# EasyEDA Pro project 程控增益块pe43711.eprj

# Schematic Schematic1

## Sheets
1 P1: Create Date: 2023-07-19; Page Name: P1; Project Name: 程控增益块pe43711; Schematic Name: Schematic1; Update Date: 2023-07-20; Company: 嘉立创EDA; Page Size: A4; Version: V1.0
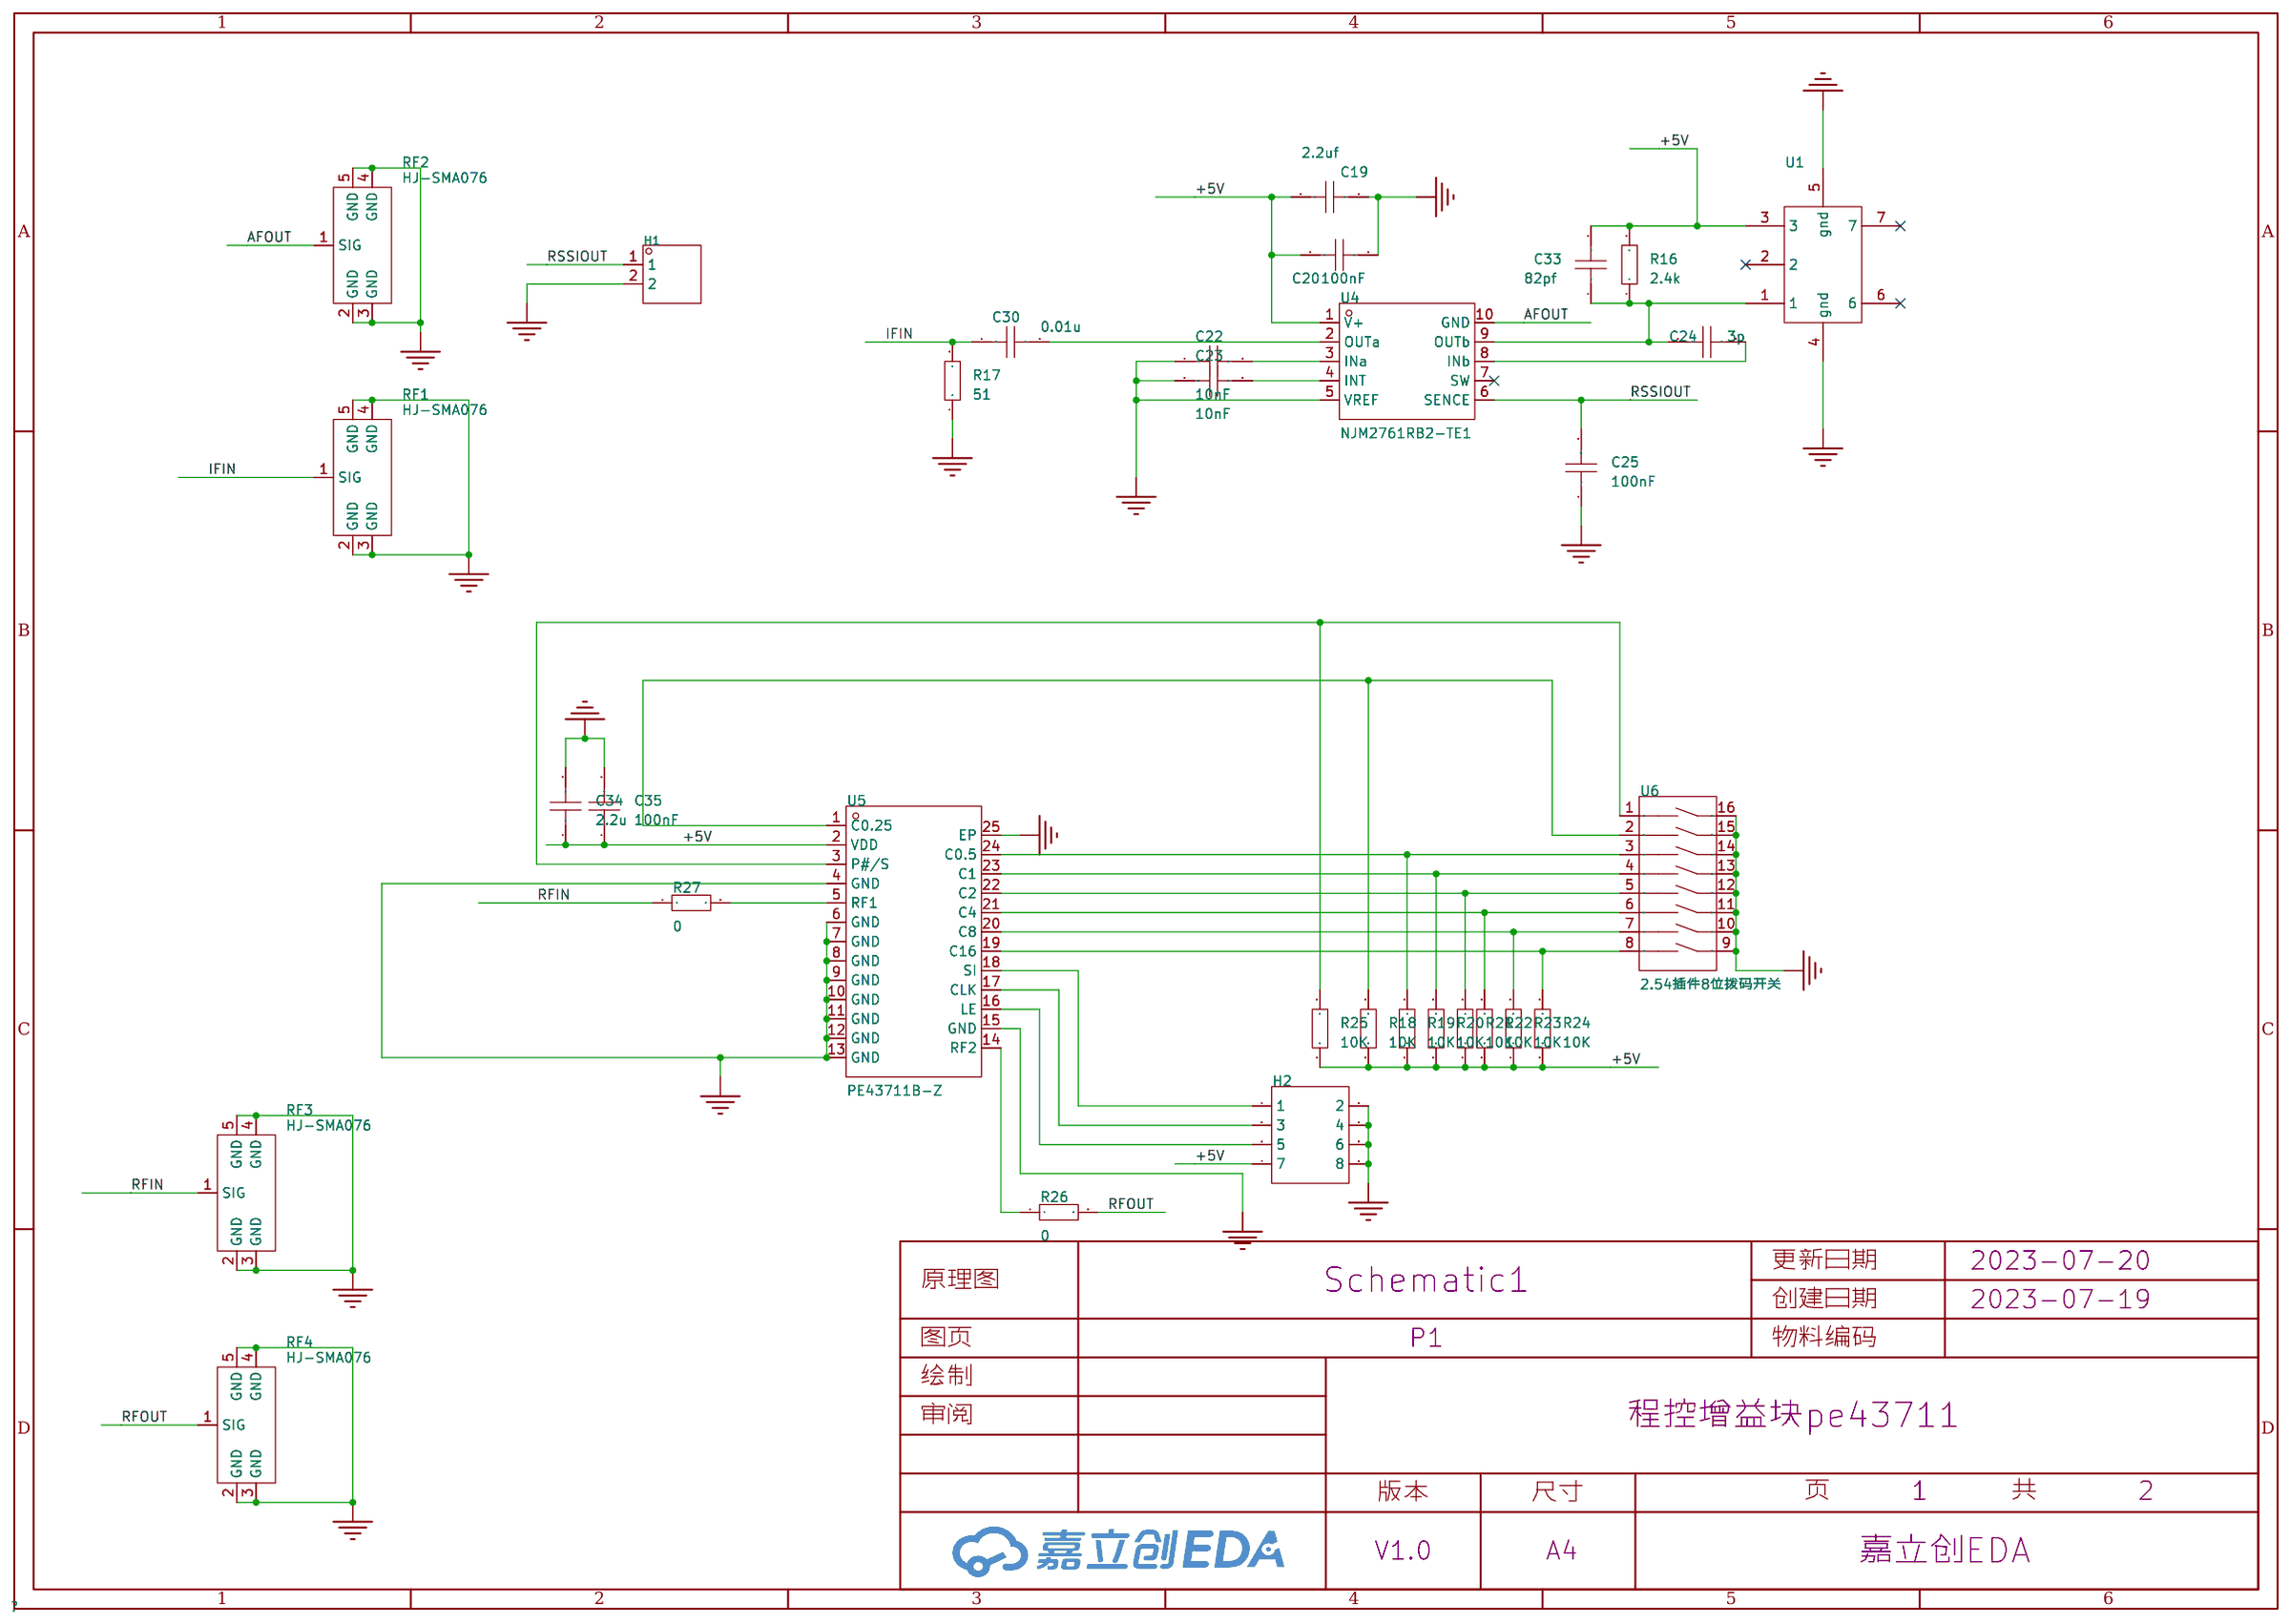
[diagram p0: P1]
2 power单: Create Date: 2023-07-20; Page Name: power单
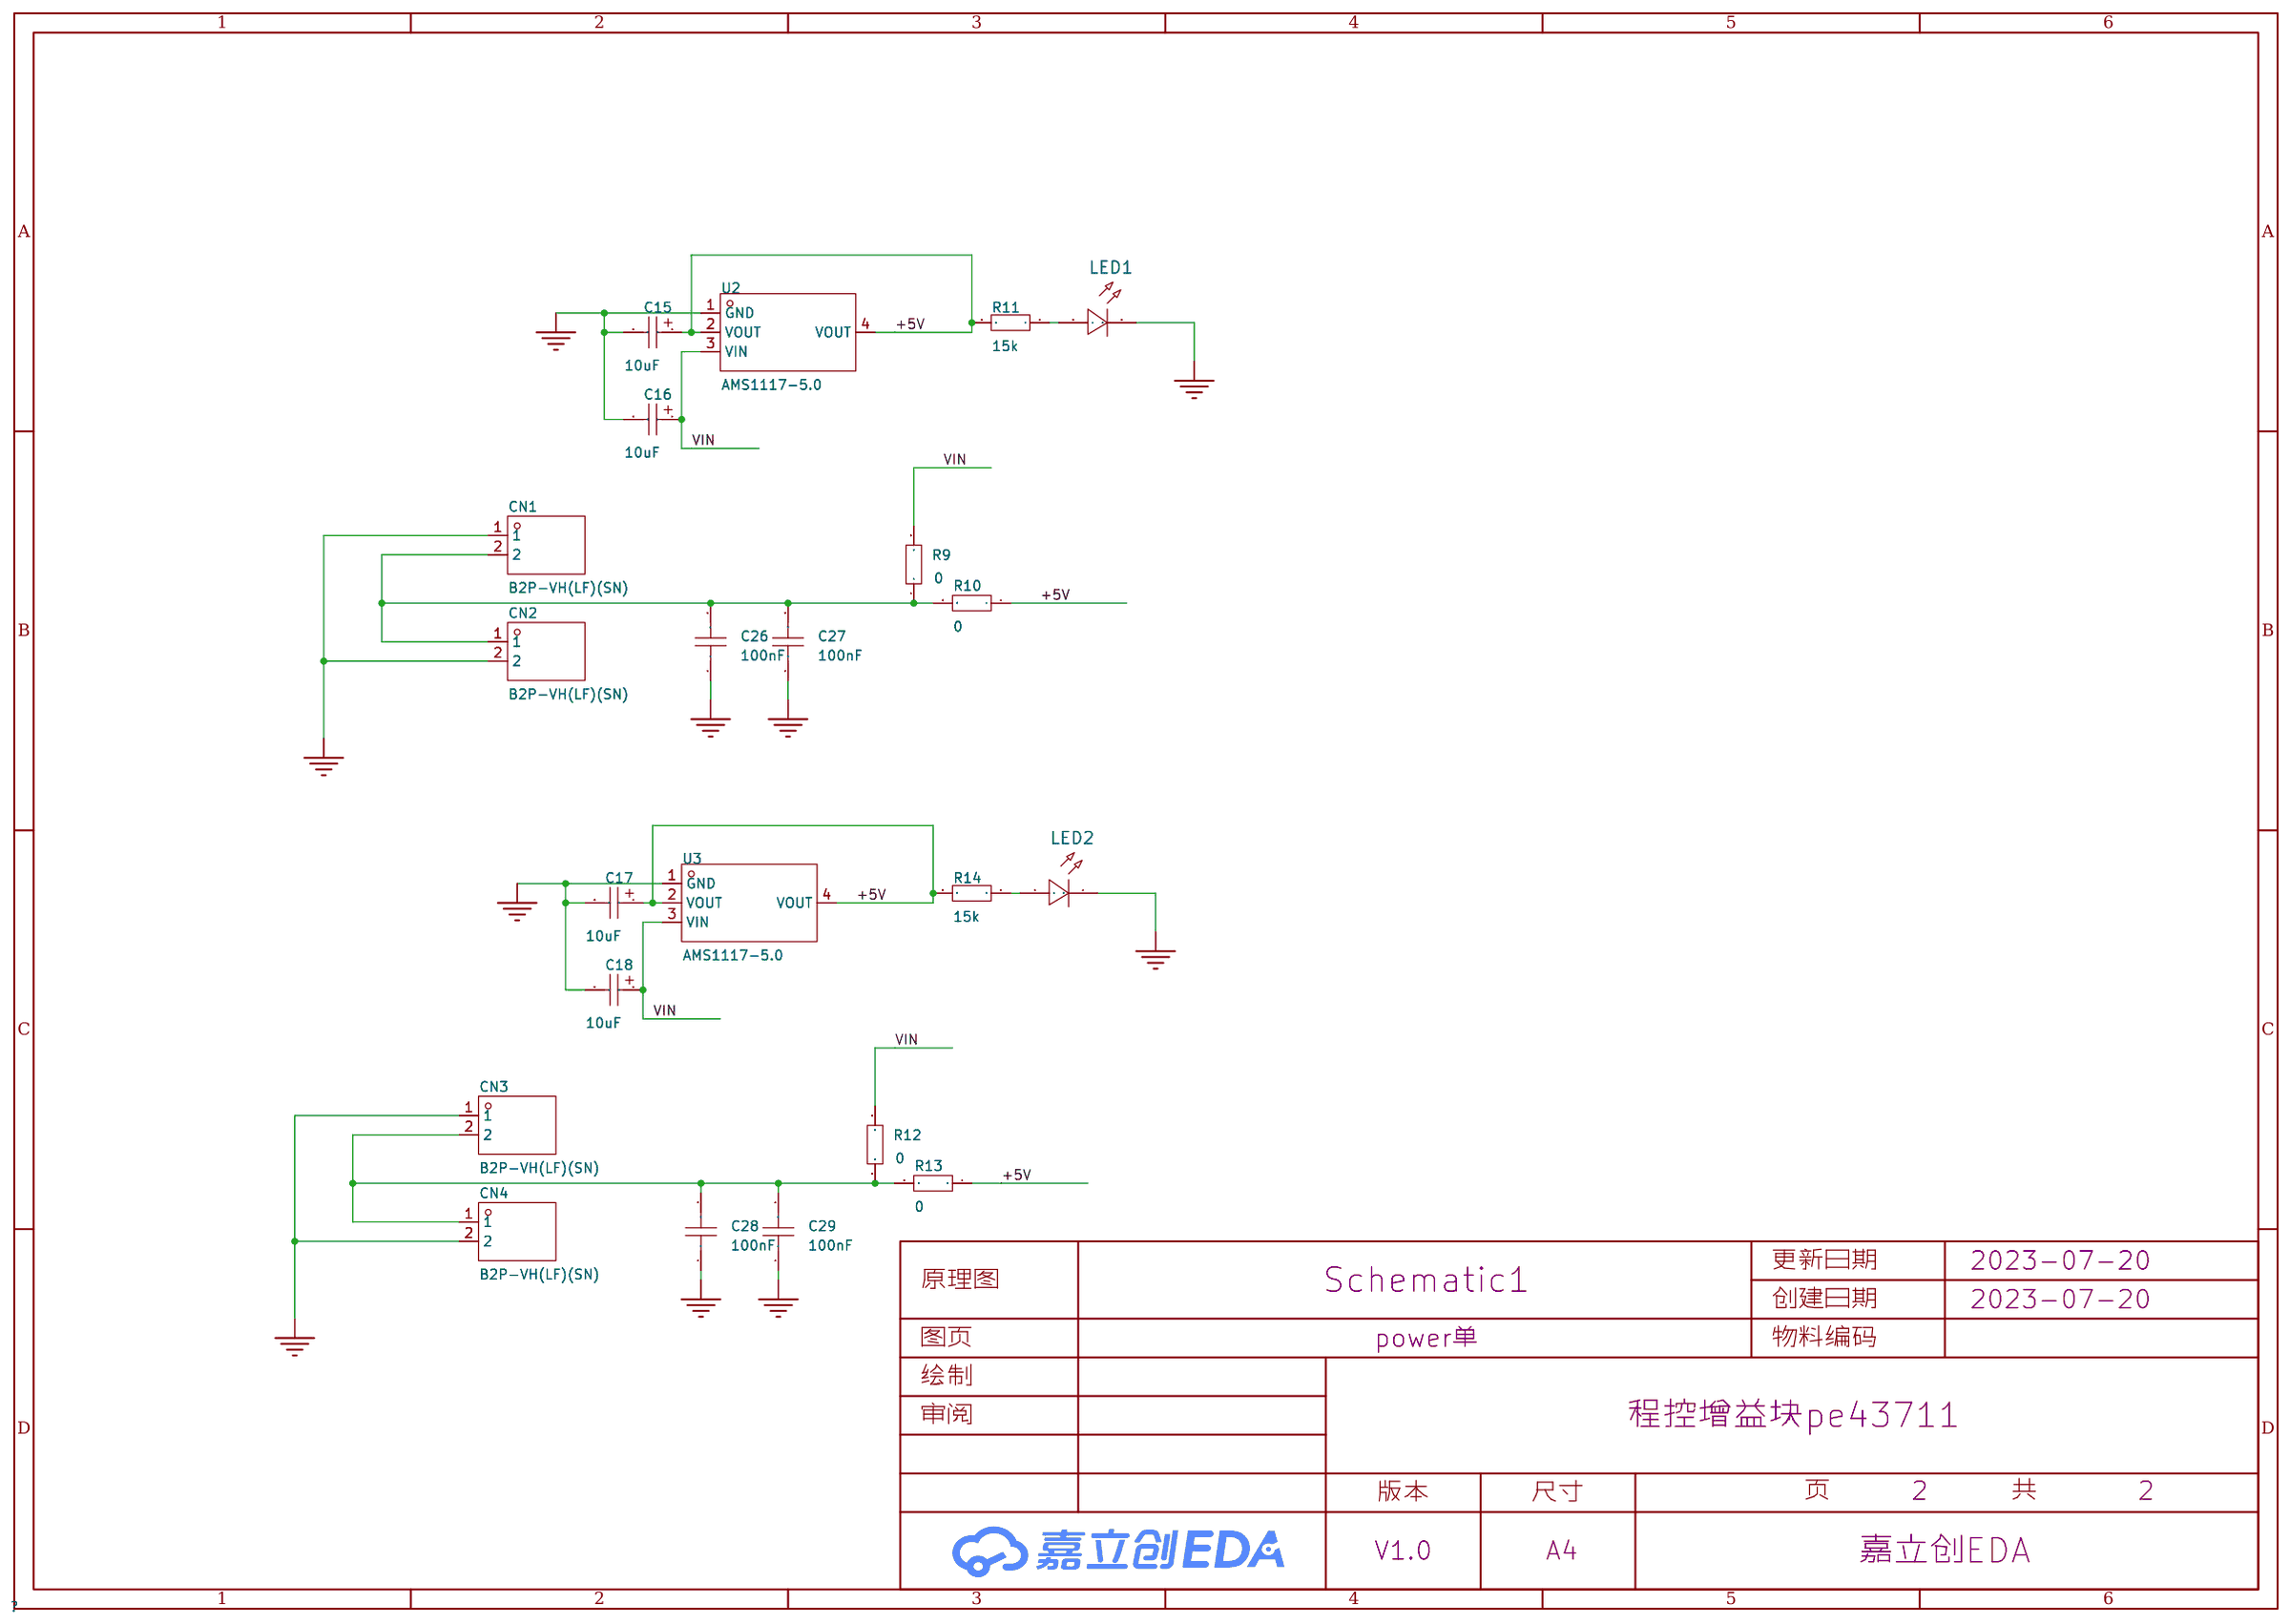
[diagram p1: power单]

## Parts
sheet P1
C19  2.2uf  [C0603]
C20  100nF  [C0603]
C22  10nF  [C0603]
C23  10nF  [C0603]
C24  3p  [C0603]
C25  100nF  [C0603]
C30  0.01u  [C0603]
C33  82pf  [C0603]
C34  2.2u  [C0603]
C35  100nF  [C0603]
H1  -  [HDR-TH_2P-P2.54-V-M-1]
H2  -  [HDR-TH_8P-P2.54-V-F-R2-C4-S2.54-1]
R16  2.4k  [R0603]
R17  51  [R0603]
R18  10K  [R0603]
R19  10K  [R0603]
R20  10K  [R0603]
R21  10K  [R0603]
R22  10K  [R0603]
R23  10K  [R0603]
R24  10K  [R0603]
R25  10K  [R0603]
R26  0  [R0603]
R27  0  [R0603]
RF1  HJ-SMA076  [SMA-SMD_HJ-SMA076]
RF2  HJ-SMA076  [SMA-SMD_HJ-SMA076]
RF3  HJ-SMA076  [SMA-SMD_HJ-SMA076]
RF4  HJ-SMA076  [SMA-SMD_HJ-SMA076]
U1  -  [中周]
U4  NJM2761RB2-TE1  [MSOP-10_L2.9-W2.8-P0.50-LS4.0-BL]
U5  PE43711B-Z  [VQFN-24_L4.0-W4.0-P0.50-BL-EP2.3]
U6  2.54插件8位拨码开关  [SW-TH_16P-L21.9-W9.9-P2.54-LS7.8]
sheet power单
C15  10uF  [CAP-SMD_L3.2-W1.6-RD-C7171]
C16  10uF  [CAP-SMD_L3.2-W1.6-RD-C7171]
C17  10uF  [CAP-SMD_L3.2-W1.6-RD-C7171]
C18  10uF  [CAP-SMD_L3.2-W1.6-RD-C7171]
C26  100nF  [C0603]
C27  100nF  [C0603]
C28  100nF  [C0603]
C29  100nF  [C0603]
CN1  B2P-VH(LF)(SN)  [CONN-TH_B2P-VH-LF-SN]
CN2  B2P-VH(LF)(SN)  [CONN-TH_B2P-VH-LF-SN]
CN3  B2P-VH(LF)(SN)  [CONN-TH_B2P-VH-LF-SN]
CN4  B2P-VH(LF)(SN)  [CONN-TH_B2P-VH-LF-SN]
LED1  -  [LED_0603]
LED2  -  [LED_0603]
R9  0  [R0603]
R10  0  [R0603]
R11  15k  [R0603]
R12  0  [R0603]
R13  0  [R0603]
R14  15k  [R0603]
U2  AMS1117-5.0  [SOT-223_L6.5-W3.5-P2.30-LS7.0-BR]
U3  AMS1117-5.0  [SOT-223_L6.5-W3.5-P2.30-LS7.0-BR]

## Library data of the parts
C19 C20 C22-C30 C33-C35 = CAP_0603: Supplier Footprint: 0603
H1 = HDR-M_2.54_1x2P: Supplier Part: C124375; Supplier Footprint: 插件
H2 = HDR-F_2.54_2x4: Supplier Part: C92271; Supplier Footprint: 插件
R9-R14 R16-R27 = Res_0603: Supplier Footprint: 0603
RF1-RF4 = HJ-SMA076: 连接器类型:板端;射频系列:SMA;接口类型:内孔;端口数量:1;阻抗:-;频率-最大值:-;样式:偏脚;接口直径:-;接口长度/高度:-;工作温度范围:-;; LCSC Part Name: SMA 内孔 偏脚 异形SMA母头母针; Supplier Part: C1509221; Manufacturer: 皇捷; Supplier Footprint: 插件; JLCPCB Part Class: 扩展库; Datasheet: https://atta.szlcsc.com/upload/public/pdf/source/20201224/C1509221_82B8BEE71B057F9D96B3EC7FCC7602D2.pdf; Supplier: LCSC; Connector Type: 板端; RF Series: SMA; Interface Type: 内孔; Number of Ports: 1; Style: 偏脚
U1 = 中周
U4 = NJM2761RB2-TE1: Supplier Part: C5360763; Manufacturer: JRC; Supplier Footprint: TVSP-10; Supplier: LCSC
U5 = PE43711B-Z: 衰减值:0dB~31.75dB;频率范围:9kHz~6GHz;阻抗:50Ω;; Supplier Part: C470929; Manufacturer: PSemi; Supplier Footprint: VQFN-24-EP(4x4); JLCPCB Part Class: 扩展库; Datasheet: https://atta.szlcsc.com/upload/public/pdf/source/20191217/C470929_FF0AB1965C9A65E441449F10D4567500.pdf; Supplier: LCSC; Attenuation Value: 0dB~31.75dB; Frequency Range: 9kHz~6GHz; Impedance: 50Ω
U6 = 2.54插件8位拨码开关: Supplier Part: C9900005795; Supplier Footprint: 插件; JLCPCB Part Class: 扩展库; Datasheet: https://atta.szlcsc.comnull; Supplier: LCSC
C15-C18 = TAJA106K016RNJ: 容值:10uF;精度:±10%;额定电压:16V;等效串联电阻:3Ω@100kHz;; LCSC Part Name: 10uF ±10% 16V; Supplier Part: C7171; Manufacturer: Kyocera AVX; Supplier Footprint: CASE-A-3216; JLCPCB Part Class: Basic Part; Datasheet: https://atta.szlcsc.com/upload/public/pdf/source/20160107/1457707748093.pdf; Supplier: LCSC; Tolerance: ±10%; Rated Voltage: 16V; Equivalent Series Resistance(ESR): 3Ω@100kHz; Operating Temperature: -55℃~+125℃
CN1-CN4 = B2P-VH (LF)(SN): 参考系列:VH;间距:3.96mm;插针结构:1x2P;排数:1;每排PIN数:2;行距:-;安装方式:-;触头材质:黄铜;; LCSC Part Name: VH 3.96mm 1x2P 直插; Supplier Part: C160315; Manufacturer: JST; Supplier Footprint: 插件,P=3.96mm; JLCPCB Part Class: Extended Part; Datasheet: https://atta.szlcsc.com/upload/public/pdf/source/20180420/C160315_19C451141449BB9E1CAF8D49BAD03192.pdf; Supplier: LCSC; Reference Series: VH; Pitch: 3.96mm; Pins Structure: 1x2P; Number of Rows: 1; Number of PINs Per Row: 2; Contact Material: 黄铜
LED1 LED2 = LED_0603-R: Supplier Footprint: 0603
U2 U3 = AMS1117-5.0_C6187: 输出类型:固定;输出极性:正;最大输入电压:15V;输出电压:5V;输出电流:1A;电源纹波抑制比(PSRR):68dB@(120Hz);; Supplier Part: C6187; Manufacturer: AMS; Supplier Footprint: SOT-223; JLCPCB Part Class: 基础库; Datasheet: https://atta.szlcsc.com/upload/public/pdf/source/20180727/C6186_7A095716F0823C02F1997A905E26C086.pdf; Supplier: LCSC; Output Type: 固定; Output Polarity: 正; Number of Outputs: 1; Maximum Input Voltage: 15V; Output Voltage: 5V; Dropout Voltage: 1.3V@(1A); Output Current: 1A; Power Supply Rejection Ratio (PSRR): 68dB@(120Hz)

## Nets
+5V: C15.1 C17.1 C19.1 C20.1 C33.2 C34.1 C35.1 H2.7 R10.1 R11.2 R13.1 R14.2 R16.2 R18.1 R19.1 R20.1 R21.1 R22.1 R23.1 R24.1 R25.1 U1.3 U2.2(VOUT) U2.4(VOUT) U3.2(VOUT) U3.4(VOUT) U4.1(V+) U5.2(VDD)
GND: C15.2 C16.2 C17.2 C18.2 C19.2 C20.2 C22.1 C23.1 C25.1 C26.1 C27.1 C28.1 C29.1 C34.2 C35.2 CN1.1 CN2.2 CN3.1 CN4.2 H1.2 H2.2 H2.4 H2.6 H2.8 LED1.1(C) LED2.1(C) R17.1 RF1.2(GND) RF1.3(GND) RF1.4(GND) RF1.5(GND) RF2.2(GND) RF2.3(GND) RF2.4(GND) RF2.5(GND) RF3.2(GND) RF3.3(GND) RF3.4(GND) RF3.5(GND) RF4.2(GND) RF4.3(GND) RF4.4(GND) RF4.5(GND) U1.4(gnd) U1.5(gnd) U2.1(GND) U3.1(GND) U4.5(VREF) U5.4(GND) U5.6(GND) U5.7(GND) U5.8(GND) U5.9(GND) U5.10(GND) U5.11(GND) U5.12(GND) U5.13(GND) U5.15(GND) U5.25(EP) U6.9 U6.10 U6.11 U6.12 U6.13 U6.14 U6.15 U6.16
VIN: C16.1 C18.1 R9.2 R12.2 U2.3(VIN) U3.3(VIN)
AFOUT: RF2.1(SIG) U4.10(GND)
IFIN: C30.1 R17.2 RF1.1(SIG)
RFIN: R27.1 RF3.1(SIG)
RFOUT: R26.2 RF4.1(SIG)
RSSIOUT: C25.2 H1.1 U4.6(SENCE)
$1N453: C22.2 U4.3(INa)
$1N456: C23.2 U4.4(INT)
$1N895: C24.2 U4.8(INb)
$1N1500: C30.2 U4.2(OUTa)
$2N826: LED1.2(A) R11.1
$2N1165: C28.2 C29.2 CN3.2 CN4.1 R12.1 R13.2
$2N1166: LED2.2(A) R14.1
$2N1726: C26.2 C27.2 CN1.2 CN2.1 R9.1 R10.2
Net-(C24-1): C24.1 C33.1 R16.1 U1.1 U4.9(OUTb)
Net-(H2-1): H2.1 U5.18(SI)
Net-(H2-3): H2.3 U5.17(CLK)
Net-(H2-5): H2.5 U5.16(LE)
Net-(R18-2): R18.2 U5.1(C0.25) U6.2
Net-(R19-2): R19.2 U5.24(C0.5) U6.3
Net-(R20-2): R20.2 U5.23(C1) U6.4
Net-(R21-2): R21.2 U5.22(C2) U6.5
Net-(R22-2): R22.2 U5.21(C4) U6.6
Net-(R23-2): R23.2 U5.20(C8) U6.7
Net-(R24-2): R24.2 U5.19(C16) U6.8
Net-(R25-2): R25.2 U5.3(P#/S) U6.1
Net-(R26-1): R26.1 U5.14(RF2)
Net-(R27-2): R27.2 U5.5(RF1)

Not connected (* = marked no-connect by the designer): U1 2* 6* 7*; U4 7(SW)*

# Board PCB1
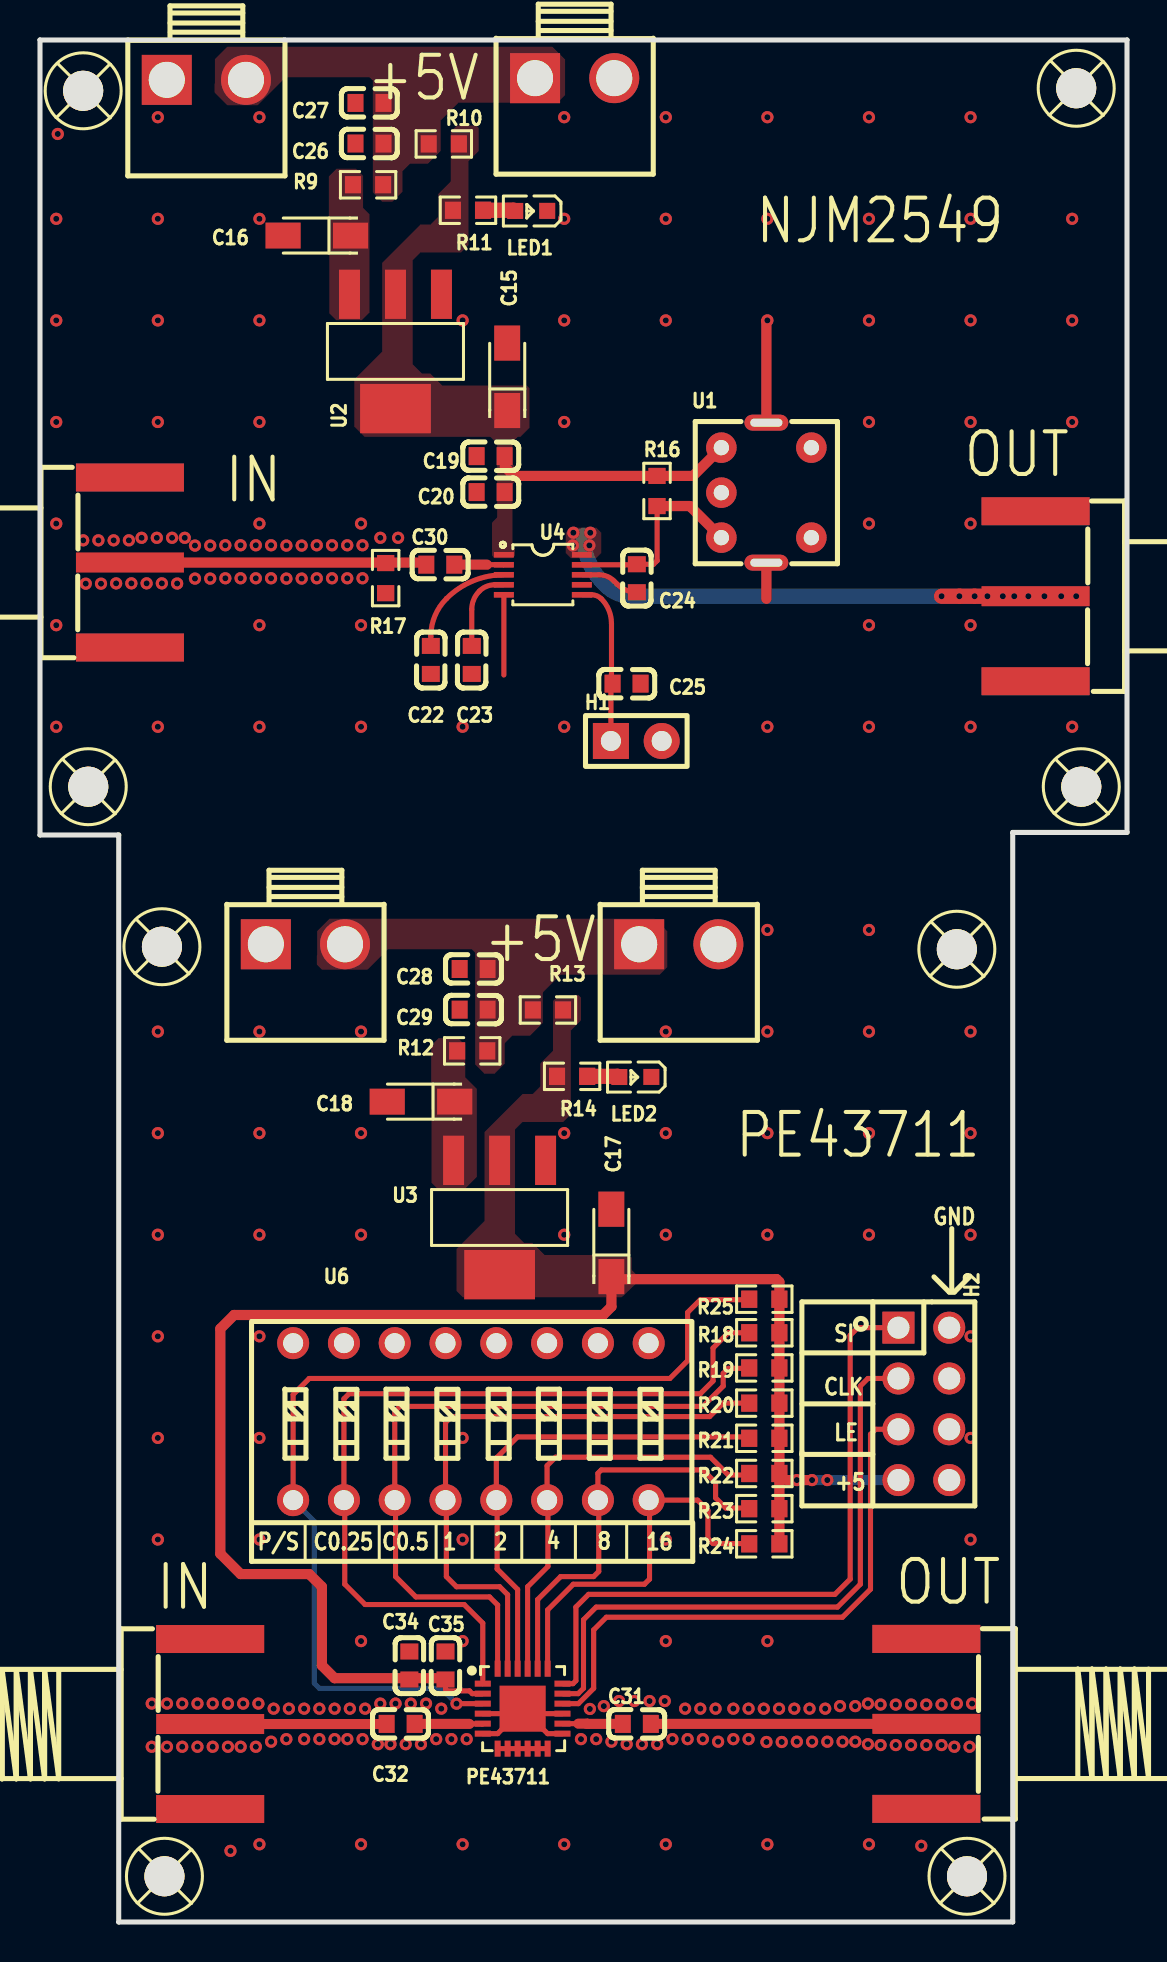
[diagram p2: board, top side]
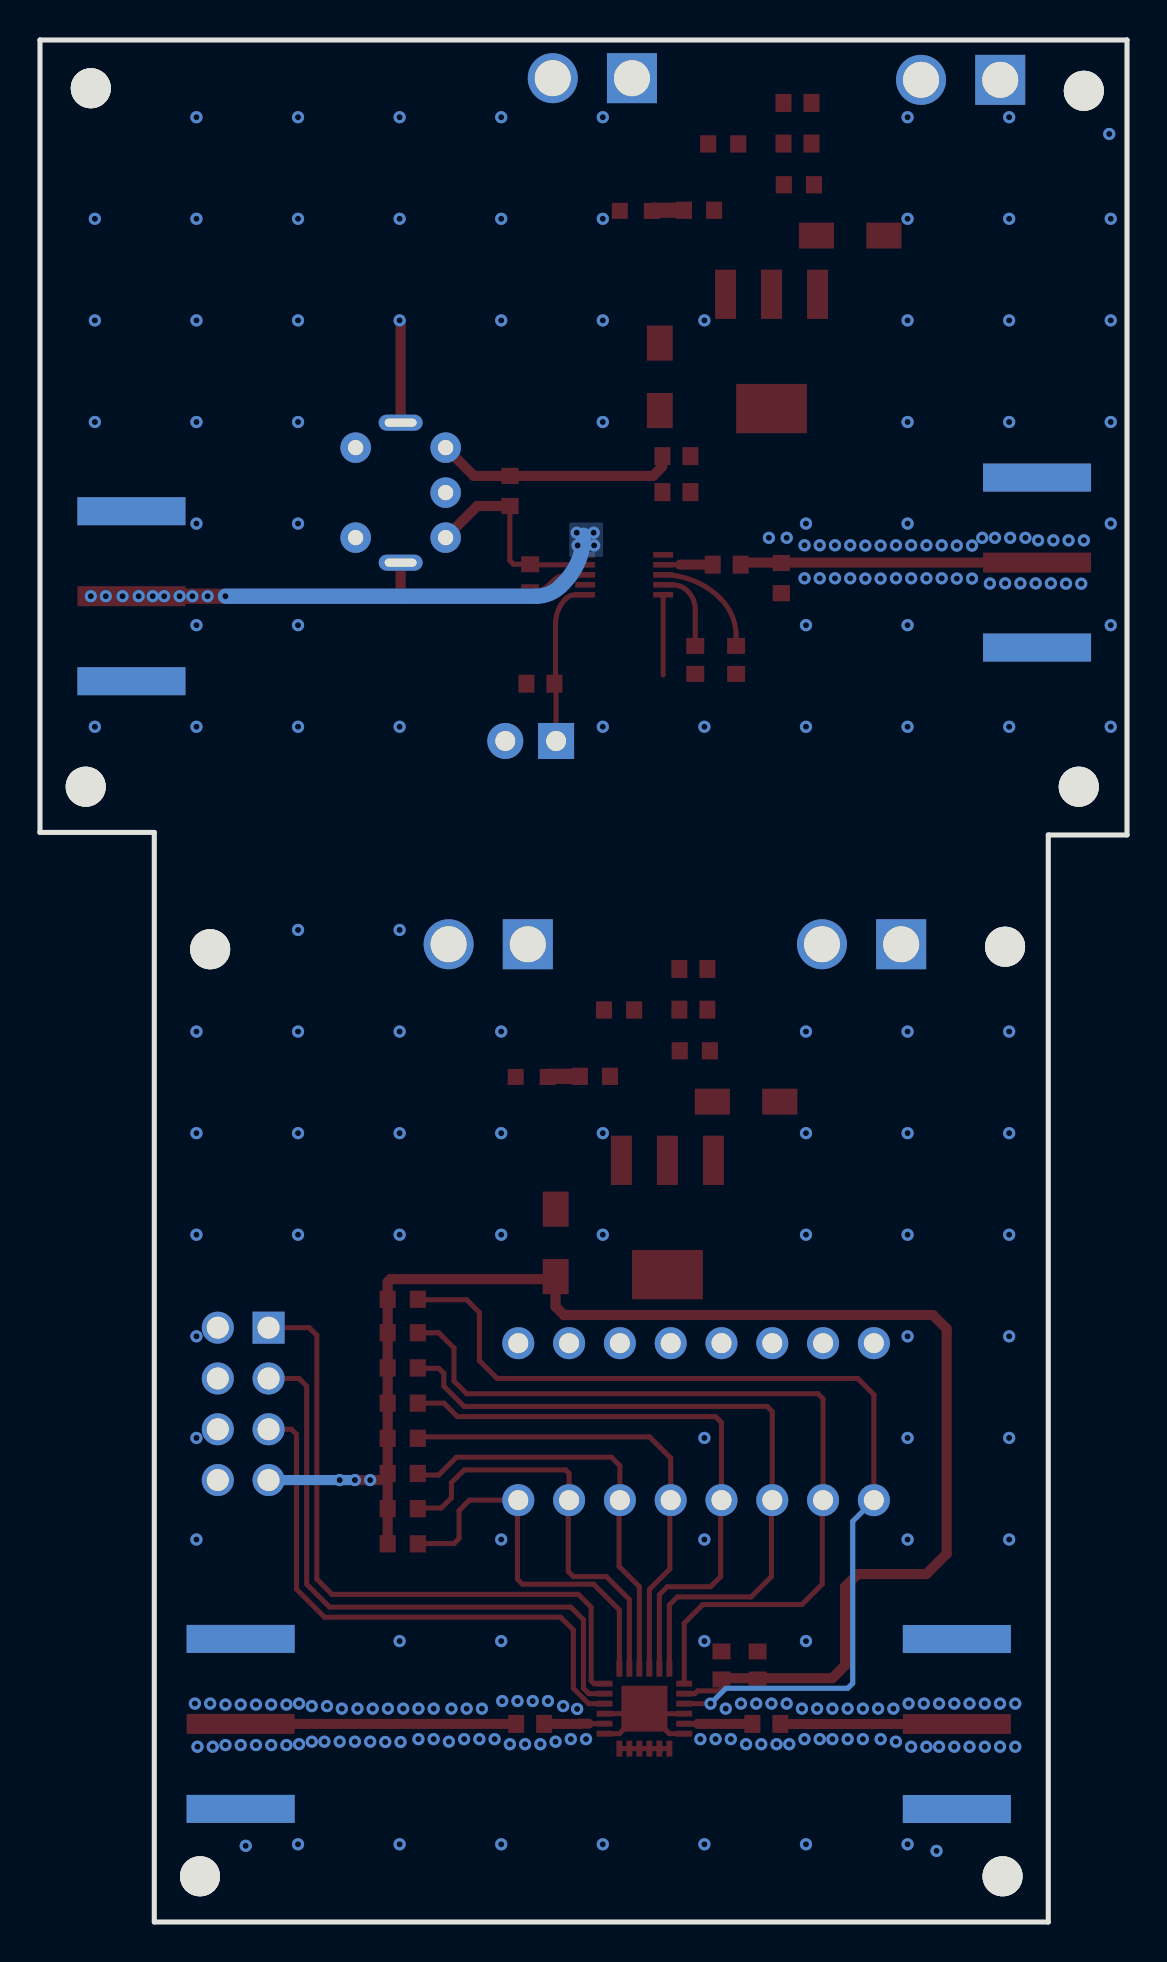
[diagram p3: board, bottom side, seen from below]

Outline 54.36 x 94.11 mm; copper layers: Top Layer, Bottom Layer. Coordinates in mm from the lower left corner of the outline.
Outline path: 0,94.11 54.36,94.11 54.36,54.48 48.64,54.48 48.64,0 3.94,0 3.94,54.36 0,54.36 0,94.11
Stack: Top Layer 0.035mm / Dielectric1 1.51mm FR4 er 4.5 / Bottom Layer 0.035mm

## Design rules (mm)
template: 自定义配置
spacing copperThickness1oz (default): track to track 0.102, other pairs 0.152 to 0.3
spacing copperThickness2oz: track to track 0.203, other pairs 0.152 to 0.3
track width copperThickness1oz (default): min 0.127, default 0.254, max 2.54
track width copperThickness2oz: min 0.203, default 0.254, max 2.54
differential pair differentialPair (default): width min 0.127, default 0.254, max 2.54; gap min 0.152, default 0.152
via viaSize (default): diameter min 0.5, default 0.61, max 10; hole min 0.3, default 0.305, max 6.299

## Placement (name value [footprint] x y rotation side)
C15  10uF  [CAP-SMD_L3.2-W1.6-RD-C7171]  23.36 77.26 90 top
C16  10uF  [CAP-SMD_L3.2-W1.6-RD-C7171]  13.84 84.33 180 top
C17  10uF  [CAP-SMD_L3.2-W1.6-RD-C7171]  28.57 33.96 90 top
C18  10uF  [CAP-SMD_L3.2-W1.6-RD-C7171]  19.05 41.02 180 top
C19  2.2uf  [C0603]  22.53 73.3 180 top
C20  100nF  [C0603]  22.53 71.5 180 top
C22  10nF  [C0603]  19.54 63.11 90 top
C23  10nF  [C0603]  21.59 63.11 90 top
C24  3p  [C0603]  29.84 67.19 270 top
C25  100nF  [C0603]  29.33 61.92 180 top
C26  100nF  [C0603]  16.48 88.93 0 top
C27  100nF  [C0603]  16.48 90.96 0 top
C28  100nF  [C0603]  21.68 47.65 0 top
C29  100nF  [C0603]  21.68 45.62 0 top
C30  0.01u  [C0603]  20.02 67.87 0 top
C31  6pf  [C0603]  29.84 9.91 0 top
C32  6pf  [C0603]  18.03 9.91 0 top
C34  2.2u  [C0603]  20.28 12.83 90 top
C35  100nF  [C0603]  18.47 12.83 90 top
CN1  B2P-VH(LF)(SN)  [CONN-TH_B2P-VH-LF-SN]  8.32 92.11 0 top
CN2  B2P-VH(LF)(SN)  [CONN-TH_B2P-VH-LF-SN]  26.74 92.2 0 top
CN3  B2P-VH(LF)(SN)  [CONN-TH_B2P-VH-LF-SN]  13.27 48.89 0 top
CN4  B2P-VH(LF)(SN)  [CONN-TH_B2P-VH-LF-SN]  31.94 48.89 0 top
H1  -  [HDR-TH_2P-P2.54-V-M-1]  29.82 59.05 0 top
H2  -  [HDR-TH_8P-P2.54-V-F-R2-C4-S2.54-1]  44.2 25.91 270 top
LED1  -  [LED_0603]  24.51 85.55 180 top
LED2  -  [LED_0603]  29.72 42.25 180 top
PE43711  PE43711B-Z  [VQFN-24_L4.0-W4.0-P0.50-BL-EP2.3]  24.13 10.67 270 top
R9  0  [R0603]  16.41 86.87 180 top
R10  0  [R0603]  20.19 88.91 180 top
R11  15k  [R0603]  21.4 85.59 180 top
R12  0  [R0603]  21.61 43.56 180 top
R13  0  [R0603]  25.4 45.6 180 top
R14  15k  [R0603]  26.61 42.29 180 top
R16  2.4k  [R0603]  30.85 71.56 90 top
R17  51  [R0603]  17.28 67.2 90 top
R18  10K  [R0603]  36.22 29.46 180 top
R19  10K  [R0603]  36.22 27.7 180 top
R20  10K  [R0603]  36.22 25.95 180 top
R21  10K  [R0603]  36.22 24.19 180 top
R22  10K  [R0603]  36.22 22.43 180 top
R23  10K  [R0603]  36.22 20.67 180 top
R24  10K  [R0603]  36.22 18.91 180 top
R25  10K  [R0603]  36.22 31.14 180 top
RF1  HJ-SMA076  [SMA-SMD_HJ-SMA076]  4.5 67.98 90 top
RF2  HJ-SMA076  [SMA-SMD_HJ-SMA076]  49.78 66.29 270 top
RF3  HJ-SMA076  [SMA-SMD_HJ-SMA076]  8.51 9.9 90 top
RF4  HJ-SMA076  [SMA-SMD_HJ-SMA076]  44.32 9.91 270 top
TP1  -  [m2螺丝]  52.07 56.77 0 top
TP1#2  -  [m2螺丝]  45.85 48.64 0 top
TP1#3  -  [m2螺丝]  51.82 91.69 0 top
TP1#4  -  [m2螺丝]  6.1 48.77 0 top
TP1#5  -  [m2螺丝]  2.16 91.57 0 top
TP1#6  -  [m2螺丝]  2.41 56.77 0 top
TP1#7  -  [m2螺丝]  46.36 2.29 0 top
TP1#8  -  [m2螺丝]  6.22 2.29 0 top
U1  -  [中周]  36.45 71.35 0 top
U2  AMS1117-5.0  [SOT-223_L6.5-W3.5-P2.30-LS7.0-BR]  17.78 78.53 90 top
U3  AMS1117-5.0  [SOT-223_L6.5-W3.5-P2.30-LS7.0-BR]  22.98 35.23 90 top
U4  NJM2761RB2-TE1  [MSOP-10_L2.9-W2.8-P0.50-LS4.0-BL]  25.15 67.37 270 top
U6  2.54插件8位拨码开关  [SW-TH_16P-L21.9-W9.9-P2.54-LS7.8]  21.55 25.02 0 top

## Footprints (pads in the part's own frame, mm; a bottom-side part is the same pattern mirrored in y, then rotated)
C0603
  rect 0.8x0.9 smd: 1(-0.7,0) 2(0.7,0)
CAP-SMD_L3.2-W1.6-RD-C7171
  rect 1.758x1.296 smd: 1(-1.687,0) 2(1.687,0)
CONN-TH_B2P-VH-LF-SN
  rect 2.5x2.5 hole 1.8: 1(-1.98,0)
  round 2.5 hole 1.8: 2(1.98,0)
HDR-TH_2P-P2.54-V-M-1
  rect 1.8x1.8 hole 1: 1(-1.27,0)
  round 1.8 hole 1: 2(1.27,0)
HDR-TH_8P-P2.54-V-F-R2-C4-S2.54-1
  rect 1.6x1.6 hole 1.1: 1(-3.81,-1.27)
  round 1.6 hole 1.1: 2(-3.81,1.27) 3(-1.27,-1.27) 4(-1.27,1.27) 5(1.27,-1.27) 6(1.27,1.27) 7(3.81,-1.27) 8(3.81,1.27)
LED_0603
  rect 0.8x0.8 smd: 1(-0.851,-0.01) 2(0.75,-0.005)
m2螺丝
  round 2 hole 3: 1(0,0)
MSOP-10_L2.9-W2.8-P0.50-LS4.0-BL
  rect 0.28x1 smd: 1(-1,-1.95) 2(-0.5,-1.95) 3(0,-1.95) 4(0.5,-1.95) 5(1,-1.95) 6(1,1.95) 7(0.5,1.95) 8(0,1.95) 9(-0.5,1.95) 10(-1,1.95)
R0603
  rect 0.806x0.864 smd: 1(-0.753,0) 2(0.753,0)
SMA-SMD_HJ-SMA076
  rect 1x5.4 smd: 1(0,0)
  rect 1.4x5.4 smd: 2(-4.25,0) 3(4.25,0)
  rect 1.4x5.4 smd far side: 4(-4.25,0) 5(4.25,0)
SOT-223_L6.5-W3.5-P2.30-LS7.0-BR
  rect 2.465x1.05 smd: 1(2.857,-2.3) 2(2.857,0) 3(2.857,2.3)
  rect 2.465x3.54 smd: 4(-2.857,0)
SW-TH_16P-L21.9-W9.9-P2.54-LS7.8
  round 1.6 hole 1: 1(-8.89,-3.925) 2(-6.35,-3.925) 3(-3.81,-3.925) 4(-1.27,-3.925) 5(1.27,-3.925) 6(3.81,-3.925) 7(6.35,-3.925) 8(8.89,-3.925) 9(8.89,3.925) 10(6.35,3.925) 11(3.81,3.925) 12(1.27,3.925) 13(-1.27,3.925) 14(-3.81,3.925) 15(-6.35,3.925) 16(-8.89,3.925)
VQFN-24_L4.0-W4.0-P0.50-BL-EP2.3
  rect 0.3x0.8 smd: 1(-1.25,-1.992) 2(-0.75,-1.992) 3(-0.25,-1.992) 4(0.25,-1.992) 5(0.75,-1.992) 6(1.25,-1.992) 13(1.25,1.992) 14(0.75,1.992) 15(0.25,1.992) 16(-0.25,1.992) 17(-0.75,1.992) 18(-1.25,1.992)
  rect 0.8x0.3 smd: 7(1.998,-1.25) 8(1.998,-0.75) 9(1.998,-0.25) 10(1.998,0.25) 11(1.998,0.75) 12(1.998,1.25) 19(-1.998,1.25) 20(-1.998,0.75) 21(-1.998,0.25) 22(-1.998,-0.25) 23(-1.998,-0.75) 24(-1.998,-1.25)
  rect 2.3x2.3 smd: 25(0.001,-0.001)
中周
  round 1.524 hole 0.762: 1(-2.377,-2.123) 2(-2.377,0.127) 3(-2.377,2.377) 6(2.123,2.377) 7(2.123,-2.123)
  rrect 2.2x0.8 hole 1.6x0.4: 4(-0.127,3.627) 5(-0.127,-3.373)

## Nets
+5V: C15.1 C17.1 C19.1 C20.1 C34.1 C35.1 H2.7 PE43711.2 R10.1 R11.2 R13.1 R14.2 R16.2 R18.1 R19.1 R20.1 R21.1 R22.1 R23.1 R24.1 R25.1 U1.3 U2.2 U2.4 U3.2 U3.4 U4.1
GND: C15.2 C16.2 C17.2 C18.2 C19.2 C20.2 C22.1 C23.1 C25.1 C26.1 C27.1 C28.1 C29.1 C34.2 C35.2 CN1.1 CN2.2 CN3.1 CN4.2 H1.2 H2.2 H2.4 H2.6 H2.8 LED1.1 LED2.1 PE43711.4 PE43711.6 PE43711.7 PE43711.8 PE43711.9 PE43711.10 PE43711.11 PE43711.12 PE43711.13 PE43711.15 PE43711.25 R17.1 RF1.2 RF1.3 RF1.4 RF1.5 RF2.2 RF2.3 RF2.4 RF2.5 RF3.2 RF3.3 RF3.4 RF3.5 RF4.2 RF4.3 RF4.4 RF4.5 U1.4 U1.5 U2.1 U3.1 U4.5 U6.9 U6.10 U6.11 U6.12 U6.13 U6.14 U6.15 U6.16
VIN: C16.1 C18.1 R9.2 R12.2 U2.3 U3.3
AFOUT: RF2.1 U4.10
IFIN: C30.1 R17.2 RF1.1
RFIN: C32.1 RF3.1
RFOUT: C31.2 RF4.1
RSSIOUT: C25.2 H1.1 U4.6
$1N453: C22.2 U4.3
$1N456: C23.2 U4.4
$1N895: C24.2 U4.8
$1N1500: C30.2 U4.2
$1N2161: PE43711.1 R18.2 U6.2
$1N2176: PE43711.24 R19.2 U6.3
$1N2183: PE43711.23 R20.2 U6.4
$1N2190: PE43711.22 R21.2 U6.5
$1N2197: PE43711.21 R22.2 U6.6
$1N2204: PE43711.20 R23.2 U6.7
$1N2211: PE43711.19 R24.2 U6.8
$1N2494: H2.1 PE43711.18
$1N2496: H2.3 PE43711.17
$1N2498: H2.5 PE43711.16
$1N2624: C31.1 PE43711.14
$1N2785: C32.2 PE43711.5
$1N3273: C24.1 R16.1 U1.1 U4.9
$1N3424: PE43711.3 R25.2 U6.1
$2N826: LED1.2 R11.1
$2N1165: C28.2 C29.2 CN3.2 CN4.1 R12.1 R13.2
$2N1166: LED2.2 R14.1
$2N1726: C26.2 C27.2 CN1.2 CN2.1 R9.1 R10.2

Pads without a net: TP1 1; TP1#2 1; TP1#3 1; TP1#4 1; TP1#5 1; TP1#6 1; TP1#7 1; TP1#8 1; U1 2 6 7; U4 7

## Via types
v1: diameter 0.61, hole 0.305, Top Layer to Bottom Layer, 258 vias

## Routing (per net, layer and track width the routed paths; a pad name or vN(x,y) marks a point on that pad's centre or on a via; arc(x,y) is an arc through that point)
+5V: length 90
  Top Layer w0.254: PE43711.2 21.62,11.42 21.48,11.56 20.36,11.56 20.28,11.64 C34.1
  Top Layer w0.508: v1(38.61,22.1) v1(37.85,22.1) 37.35,22.1 ; 23.24,72.77 23.7,72.31 R16.2 32.66,72.31 U1.3 ; C34.1 20.21,12.19 14.73,12.19 14.1,12.83 14.1,16.76 13.46,17.4 10.03,17.4 9.02,18.41 9.02,29.66 9.71,30.35 28.16,30.35 28.58,30.77 28.58,32.14 36.83,32.14 36.97,32.01 R25.1 R18.1 R19.1 R20.1 R21.1 R22.1 R23.1 R24.1
  Bottom Layer w0.508: v1(38.61,22.1) v1(39.37,22.1) 42.93,22.1
GND: length 22
  Top Layer w0.254: PE43711.13 25.38,9.42 24.38,10.42 ; 24.38,10.42 PE43711.25 23.88,10.42 ; 24.38,10.42 PE43711.15 ; 23.88,10.42 PE43711.4 ; 23.88,10.42 22.88,9.42 PE43711.6 ; 23.2,66.37 23.2,62.36 ; PE43711.12 PE43711.11 PE43711.10 PE43711.9 PE43711.8 PE43711.7
  Top Layer w0.508: U1.4 36.32,80.04 v1(36.37,80.09) ; U1.5 36.32,66.17
  vias: v1(0.81,85.17) v1(0.81,80.09) v1(0.81,75.01) v1(0.81,69.93) v1(0.81,64.85) v1(0.81,59.77) v1(0.89,89.41) v1(2.16,69.09) v1(2.29,66.92) v1(2.92,69.09) v1(3.05,66.92) v1(3.68,69.09) v1(3.81,66.94) v1(4.44,69.09) v1(4.57,66.94) v1(5.08,69.21) v1(5.33,66.94) v1(5.59,10.92) v1(5.59,8.76) v1(5.89,90.25) v1(5.89,85.17) v1(5.89,80.09) v1(5.89,75.01) v1(5.84,69.21) v1(5.89,59.77) v1(5.89,44.53) v1(5.89,39.45) v1(5.89,34.37) v1(5.89,29.29) v1(5.89,24.21) v1(5.89,19.13) v1(6.09,66.94) v1(6.35,10.92) v1(6.35,8.76) v1(6.6,69.21) v1(6.86,66.93) v1(7.11,10.92) v1(7.11,8.76) v1(7.24,69.21) v1(7.75,68.83) v1(7.75,67.18) v1(7.87,10.92) v1(7.87,8.76) v1(8.51,68.83) v1(8.51,67.18) v1(8.64,10.92) v1(8.64,8.76) v1(9.27,68.84) v1(9.27,67.19) v1(9.4,10.92) v1(9.4,8.76) v1(9.53,3.56) v1(10.03,68.84) v1(10.03,67.19) v1(10.03,8.76) v1(10.16,10.92) v1(10.79,68.84) v1(10.79,67.19) v1(10.8,8.76) v1(10.97,90.25) v1(10.97,85.17) v1(10.97,80.09) v1(10.97,75.01) v1(10.97,69.93) v1(10.97,64.85) v1(10.97,59.77) v1(10.97,44.53) v1(10.97,39.45) v1(10.97,34.37) v1(10.97,29.29) v1(10.97,24.21) v1(10.97,19.13) v1(10.92,10.92) v1(10.97,3.89) v1(11.55,68.84) v1(11.55,67.19) v1(11.56,9.02) v1(11.68,10.67) v1(12.32,68.83) v1(12.32,67.18) v1(12.32,9.14) v1(12.45,10.67) v1(13.08,68.83) v1(13.08,67.18) v1(13.21,10.67) v1(13.21,9.14) v1(13.84,68.84) v1(13.84,67.19) v1(13.97,10.67) v1(13.97,9.14) v1(14.6,68.84) v1(14.6,67.19) v1(14.73,10.67) v1(14.73,9.14) v1(15.36,68.84) v1(15.36,67.19) v1(15.37,9.14) v1(15.49,10.67) v1(16.05,69.93) v1(16.05,64.85) v1(16.05,59.77) v1(16.05,44.53) v1(16.05,39.45) v1(16.05,34.37) v1(16.05,14.05) v1(16.05,3.89) v1(16.13,68.84) v1(16.13,67.19) v1(16.13,9.14) v1(16.26,10.67) v1(16.89,8.89) v1(17.02,69.21) v1(17.02,10.92) v1(17.53,8.89) v1(17.78,10.92) v1(17.91,69.21) v1(18.29,8.89) v1(18.54,10.92) v1(19.05,8.89) v1(19.3,10.92) v1(19.81,9.14) v1(20.07,10.67) v1(20.57,9.14) v1(21.13,80.09) v1(21.13,59.77) v1(21.13,24.21) v1(21.13,19.13) v1(21.13,14.05) v1(21.13,3.89) v1(21.34,9.14) v1(26.21,90.25) v1(26.21,85.17) v1(26.21,80.09) v1(26.21,75.01) v1(26.21,59.77) v1(26.21,39.45) v1(26.21,34.37) v1(26.21,3.89) v1(27.05,9.14) v1(27.5,10.65) v1(27.81,9.14) v1(28.19,10.79) v1(28.58,9.02) v1(28.96,11.05) v1(29.34,8.89) v1(29.72,11.05) v1(30.1,8.89) v1(30.48,11.05) v1(30.86,8.89) v1(31.29,90.25) v1(31.29,85.17) v1(31.29,80.09) v1(31.29,44.53) v1(31.29,39.45) v1(31.29,34.37) v1(31.29,19.13) v1(31.29,14.05) v1(31.24,11.05) v1(31.29,3.89) v1(31.62,9.14) v1(32.26,10.67) v1(32.39,9.14) v1(33.02,10.67) v1(33.15,9.14) v1(33.78,10.67) v1(33.91,9.02) v1(34.67,10.67) v1(34.67,9.14) v1(35.43,10.67) v1(35.43,9.14) v1(36.19,10.67) v1(36.37,90.25) v1(36.37,85.17) v1(36.37,59.77) v1(36.37,49.61) v1(36.37,44.53) v1(36.37,39.45) v1(36.37,34.37) v1(36.37,14.05) v1(36.33,9) v1(36.37,3.89) v1(36.96,10.67) v1(37.09,9) v1(37.72,10.67) v1(37.85,9.02) v1(38.48,10.67) v1(38.61,9.02) v1(39.26,10.67) v1(39.37,9.02) v1(40,10.79) v1(40.13,9.02) v1(40.77,10.79) v1(40.77,9.02) v1(41.4,10.92) v1(41.4,8.89) v1(41.45,90.25) v1(41.45,85.17) v1(41.45,80.09) v1(41.45,75.01) v1(41.45,69.93) v1(41.45,64.85) v1(41.45,59.77) v1(41.45,49.61) v1(41.45,44.53) v1(41.45,39.45) v1(41.45,34.37) v1(41.45,3.89) v1(42.03,10.87) v1(42.03,8.85) v1(42.8,10.87) v1(42.8,8.85) v1(43.56,10.87) v1(43.56,8.85) v1(44.07,3.81) v1(44.32,10.87) v1(44.32,8.85) v1(45.08,10.87) v1(45.08,8.85) v1(45.72,8.76) v1(45.85,10.92) v1(46.48,8.76) v1(46.53,90.25) v1(46.53,85.17) v1(46.53,80.09) v1(46.53,75.01) v1(46.53,69.93) v1(46.53,64.85) v1(46.53,59.77) v1(46.53,44.53) v1(46.53,39.45) v1(46.53,34.37) v1(46.53,29.29) v1(46.53,24.21) v1(46.53,19.13) v1(46.61,10.92) v1(51.61,85.17) v1(51.61,80.09) v1(51.61,75.01) v1(51.61,59.77)
AFOUT: length 24.5
  Top Layer w0.762: v1(45.09,66.29) v1(45.97,66.29) v1(46.74,66.29) v1(47.38,66.29) v1(48.15,66.29) v1(48.72,66.29) v1(49.42,66.29) RF2.1
  Bottom Layer w0.762: v1(45.09,66.29) 29.55,66.29 arc(28.88,66.43) 28.32,66.8 28.17,66.96 arc(27.55,67.8) 27.22,68.79 arc(27.19,69.07) 27.18,69.34
  vias: v1(26.67,69.47) v1(26.65,68.83) v1(27.47,68.83) v1(27.52,69.47) v1(50.23,66.29) v1(51.07,66.29) v1(51.82,66.29)
IFIN: length 14.9
  Top Layer w0.503: RF1.1 19.32,67.98 C30.1
RFIN: length 8.8
  Top Layer w0.152: RF3.1 10.03,9.9
  Top Layer w0.503: 10.03,9.9 17.33,9.9 C32.1
RFOUT: length 13.8
  Top Layer w0.503: C31.2 RF4.1
RSSIOUT: length 8.4
  Top Layer w0.254: H1.1 28.55,61.72 arc(28.56,61.78) 28.57,61.84 ; U4.6 27.59,66.37 arc(27.85,66.31) 28.07,66.17 arc(28.44,65.6) 28.58,64.94 28.58,64.94 28.58,62.4 28.58,62.4 arc(28.57,62.12) 28.57,61.84 ; 28.57,61.84 arc(28.57,61.78) 28.57,61.72
$1N453: length 5.8
  Top Layer w0.254: C22.2 19.54,64.29 arc(19.75,65.31) 20.32,66.17 20.33,66.18 arc(21.65,67.06) 23.2,67.37
$1N456: length 4.2
  Top Layer w0.254: C23.2 21.59,65.63 arc(21.69,66.13) 21.97,66.55 arc(22.32,66.78) 22.74,66.87 23.2,66.87
$1N895: length 3
  Top Layer w0.254: U4.8 27.95,67.37 arc(28.36,67.29) 28.7,67.06 28.86,66.9 arc(29.31,66.6) C24.2
$1N1500: length 2.5
  Top Layer w0.254: 23.2,67.87 23.2,67.87 22.35,67.87
  Top Layer w0.503: C30.2 22.35,67.87
$1N2161: length 42.6
  Top Layer w0.254: R18.2 34.42,29.46 33.66,28.7 33.66,27.05 33.02,26.42 15.45,26.42 15.2,26.16 15.2,21.09 15.24,21.05 15.24,16.89 16.26,15.88 21.21,15.88 22.14,14.94 22.14,11.92
$1N2176: length 36.2
  Top Layer w0.254: R19.2 35.45,27.69 34.42,27.69 34.16,27.43 34.16,26.8 33.15,25.78 17.99,25.78 17.74,25.53 17.74,21.09 17.78,21.05 17.78,17.27 18.8,16.26 22.48,16.26 22.88,15.85 22.88,12.67
$1N2183: length 30.5
  Top Layer w0.254: 23.38,12.67 23.38,16.37 22.99,16.76 20.83,16.76 20.32,17.27 20.32,21.05 20.28,21.09 20.28,24.98 20.57,25.27 33.49,25.27 34.16,25.95 R20.2
$1N2190: length 24.1
  Top Layer w0.254: R21.2 35.4,24.26 23.88,24.26 22.82,23.2 22.82,21.09 22.86,21.05 22.86,17.65 23.88,16.63 23.88,12.67
$1N2197: length 21.3
  Top Layer w0.254: R22.2 35.39,22.35 34.42,22.35 33.53,23.24 25.78,23.24 25.36,22.82 25.36,21.09 25.4,21.05 25.4,17.78 24.38,16.76 24.38,12.67
$1N2204: length 20.9
  Top Layer w0.254: 24.88,12.67 24.88,16.12 26.03,17.27 27.69,17.27 27.94,17.53 27.94,21.05 27.9,21.09 27.9,22.44 28.07,22.61 33.15,22.61 33.78,21.97 33.78,21.21 34.29,20.7 35.43,20.7 R23.2
$1N2211: length 19.4
  Top Layer w0.254: 25.38,12.67 25.38,15.6 26.67,16.89 30.23,16.89 30.48,17.14 30.48,21.05 30.44,21.09 32.88,21.09 33.4,20.57 33.4,19.18 33.66,18.92 35.45,18.92 R24.2
$1N2494: length 33.5
  Top Layer w0.254: 42.93,29.72 40.89,29.72 40.51,29.34 40.51,17.14 39.75,16.38 27.43,16.38 26.8,15.75 26.8,12.06 26.65,11.92 26.13,11.92
$1N2496: length 31.1
  Top Layer w0.254: PE43711.17 26.91,11.42 27.18,11.68 27.18,15.11 27.81,15.75 39.88,15.75 41.02,16.89 41.02,26.8 41.4,27.18 42.93,27.18
$1N2498: length 28.7
  Top Layer w0.254: 42.93,24.64 41.78,24.64 41.53,24.38 41.53,16.64 40.13,15.24 28.32,15.24 27.69,14.6 27.69,11.68 26.92,10.92 26.13,10.92
$1N2624: length 3
  Top Layer w0.254: 26.13,9.92 26.92,9.92
  Top Layer w0.503: 26.92,9.92 27.36,9.92 27.37,9.91 C31.1
$1N2785: length 3.4
  Top Layer w0.254: 22.14,9.92 22.13,9.91 21.47,9.91
  Top Layer w0.503: 18.73,9.91 21.47,9.91
$1N3273: length 10.5
  Top Layer w0.254: U4.9 29.84,67.87 29.84,67.89 30.68,67.89 30.86,68.07 30.86,70.8 R16.1
  Top Layer w0.508: R16.1 32.49,70.8 U1.1
$1N3424: length 49.9
  Top Layer w0.254: R25.2 35.44,31.11 33.02,31.11 32.39,30.48 32.39,28.07 31.5,27.18 13.46,27.18 12.66,26.37 12.66,21.09 ; 22.14,10.92 v1(20.83,10.92)
  Bottom Layer w0.254: 12.66,21.09 13.72,20.04 13.72,11.94 13.97,11.68 20.06,11.68 v1(20.83,10.92)
$2N826: length 1.6
  Top Layer w0.762: R11.1 23.68,85.59 arc(23.72,85.59) LED1.2
$2N1166: length 1.6
  Top Layer w0.762: 27.36,42.29 28.89,42.29 arc(28.93,42.28) 28.97,42.25

## Copper pours and planes (outline as drawn; the poured copper is in the pictures)
+5V on Top Layer: 29.08,32.99 30.04,32.99 30.04,31.24 29.08,31.24
+5V on Top Layer: 23.23,73.3 24.22,73.3 24.22,71.5 23.23,71.5
+5V on Top Layer: 20.83,46.35 29.59,46.35 29.59,31.24 20.83,31.24
+5V on Top Layer: 22.25,74.53 24,74.53 24,68.2 22.25,68.2
+5V on Top Layer: 15.72,89.83 24.48,89.83 24.48,74.27 15.72,74.27
GND on Top Layer: -15.75,105.92 67.31,105.92 67.31,-14.35 -15.75,-14.35
GND on Bottom Layer: -8.89,99.06 72.64,99.06 72.64,-4.95 -8.89,-4.95
VIN on Top Layer: 19.56,44.2 21.84,44.2 21.84,36.62 19.56,36.62
VIN on Top Layer: 14.45,87.67 16.48,87.67 16.48,80.1 14.45,80.1
AFOUT on Top Layer: 26.29,69.72 28.07,69.72 28.07,68.2 26.29,68.2
AFOUT on Bottom Layer: 26.21,69.98 27.88,69.98 27.88,68.27 26.21,68.27
$2N1165 on Top Layer: 13.84,50.16 31.37,50.16 31.37,42.42 13.84,42.42
$2N1726 on Top Layer: 8.73,93.77 26.26,93.77 26.26,86.02 8.73,86.02

Small or netless copper shapes (teardrops, artwork), in the pictures only: 1 on Top Layer

## Text on the board
Top Silkscreen Layer: P/S | C0.25 | C0.5 | 1 | 2 | 4 | 8 | 16 | CLK | SI | LE | +5 | GND | IN | +5V | PE43711 | NJM2549 | OUT
